# Altium schematic sheet nRF51822-Module.SchDoc
size A4
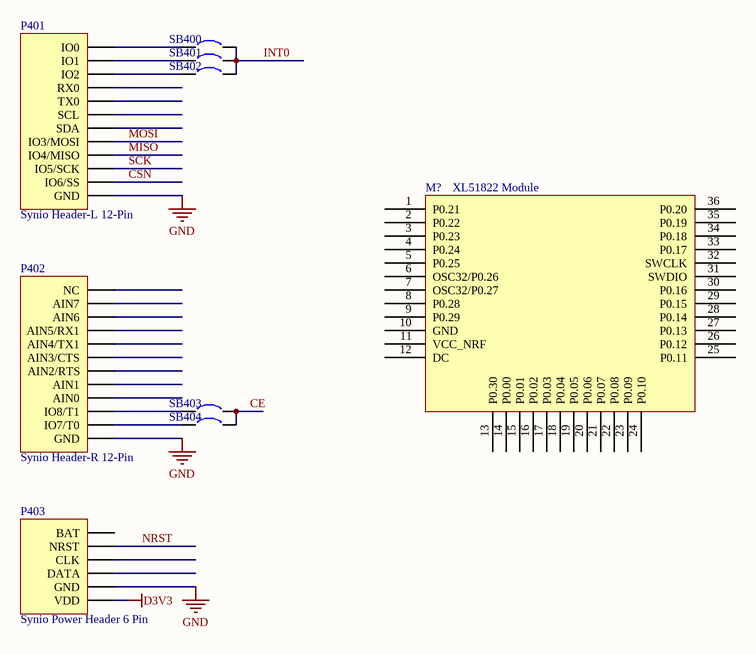
[diagram p0: nRF51822-Module.SchDoc]

## Parts
M?  XL51822 Module  [XL51822]
P401  Synio Header-L 12-Pin  [HDR1X12]
P402  Synio Header-R 12-Pin  [HDR1X12]
P403  Synio Power Header 6 Pin  [HDR1X6/2.54MM]
SB400  Circuit Breaker  [JP2_SMD]  (value not drawn)
SB401  Circuit Breaker  [JP2_SMD]  (value not drawn)
SB402  Circuit Breaker  [JP2_SMD]  (value not drawn)
SB403  Circuit Breaker  [JP2_SMD]  (value not drawn)
SB404  Circuit Breaker  [JP2_SMD]  (value not drawn)

## Nets
D3V3: P403.1(VDD)
GND: P401.1(GND) P402.1(GND) P403.2(GND)
CE: SB403.2 SB404.2
CSN: P401.2(IO6/SS)
INT0: SB400.2 SB401.2 SB402.2
MISO: P401.4(IO4/MISO)
MOSI: P401.5(IO3/MOSI)
NRST: P403.5(NRST)
SCK: P401.3(IO5/SCK)
NetP401_10: P401.10(IO2) SB402.1
NetP401_11: P401.11(IO1) SB401.1
NetP401_12: P401.12(IO0) SB400.1
NetP402_2: P402.2(IO7/T0) SB404.1
NetP402_3: P402.3(IO8/T1) SB403.1

Not connected (* = marked no-connect by the designer): M? 1(P0.21) 2(P0.22) 3(P0.23) 4(P0.24) 5(P0.25) 6(OSC32/P0.26) 7(OSC32/P0.27) 8(P0.28) 9(P0.29) 10(GND) 11(VCC_NRF) 12(DC) 13(P0.30) 14(P0.00) 15(P0.01) 16(P0.02) 17(P0.03) 18(P0.04) 19(P0.05) 20(P0.06) 21(P0.07) 22(P0.08) 23(P0.09) 24(P0.10) 25(P0.11) 26(P0.12) 27(P0.13) 28(P0.14) 29(P0.15) 30(P0.16) 31(SWDIO) 32(SWCLK) 33(P0.17) 34(P0.18) 35(P0.19) 36(P0.20); P401 6(SDA) 7(SCL) 8(TX0) 9(RX0); P402 4(AIN0) 5(AIN1) 6(AIN2/RTS) 7(AIN3/CTS) 8(AIN4/TX1) 9(AIN5/RX1) 10(AIN6) 11(AIN7) 12(NC); P403 3(DATA) 4(CLK) 6(BAT)

## Library data of the parts
M? = XL51822
P401 = Synio Header-L 12-Pin: Synio Header-L, 12-Pin; LatestRevisionDate: 17-Jul-2002; LatestRevisionNote: Re-released for DXP Platform.; Publisher: Altium Limited
P402 = Synio Header-R 12-Pin: Synio Header-R, 12-Pin; LatestRevisionDate: 17-Jul-2002; LatestRevisionNote: Re-released for DXP Platform.; Publisher: Altium Limited
SB400-SB404 = Circuit Breaker: Solder: YES; Published: 24-Mar-1999; Revision: July-2002: Re-released for DXP Platform.; Publisher: Altium Limited